# EAGLE design SmartHomePLC_Licenta.V2sch (EAGLE 6.6.0)
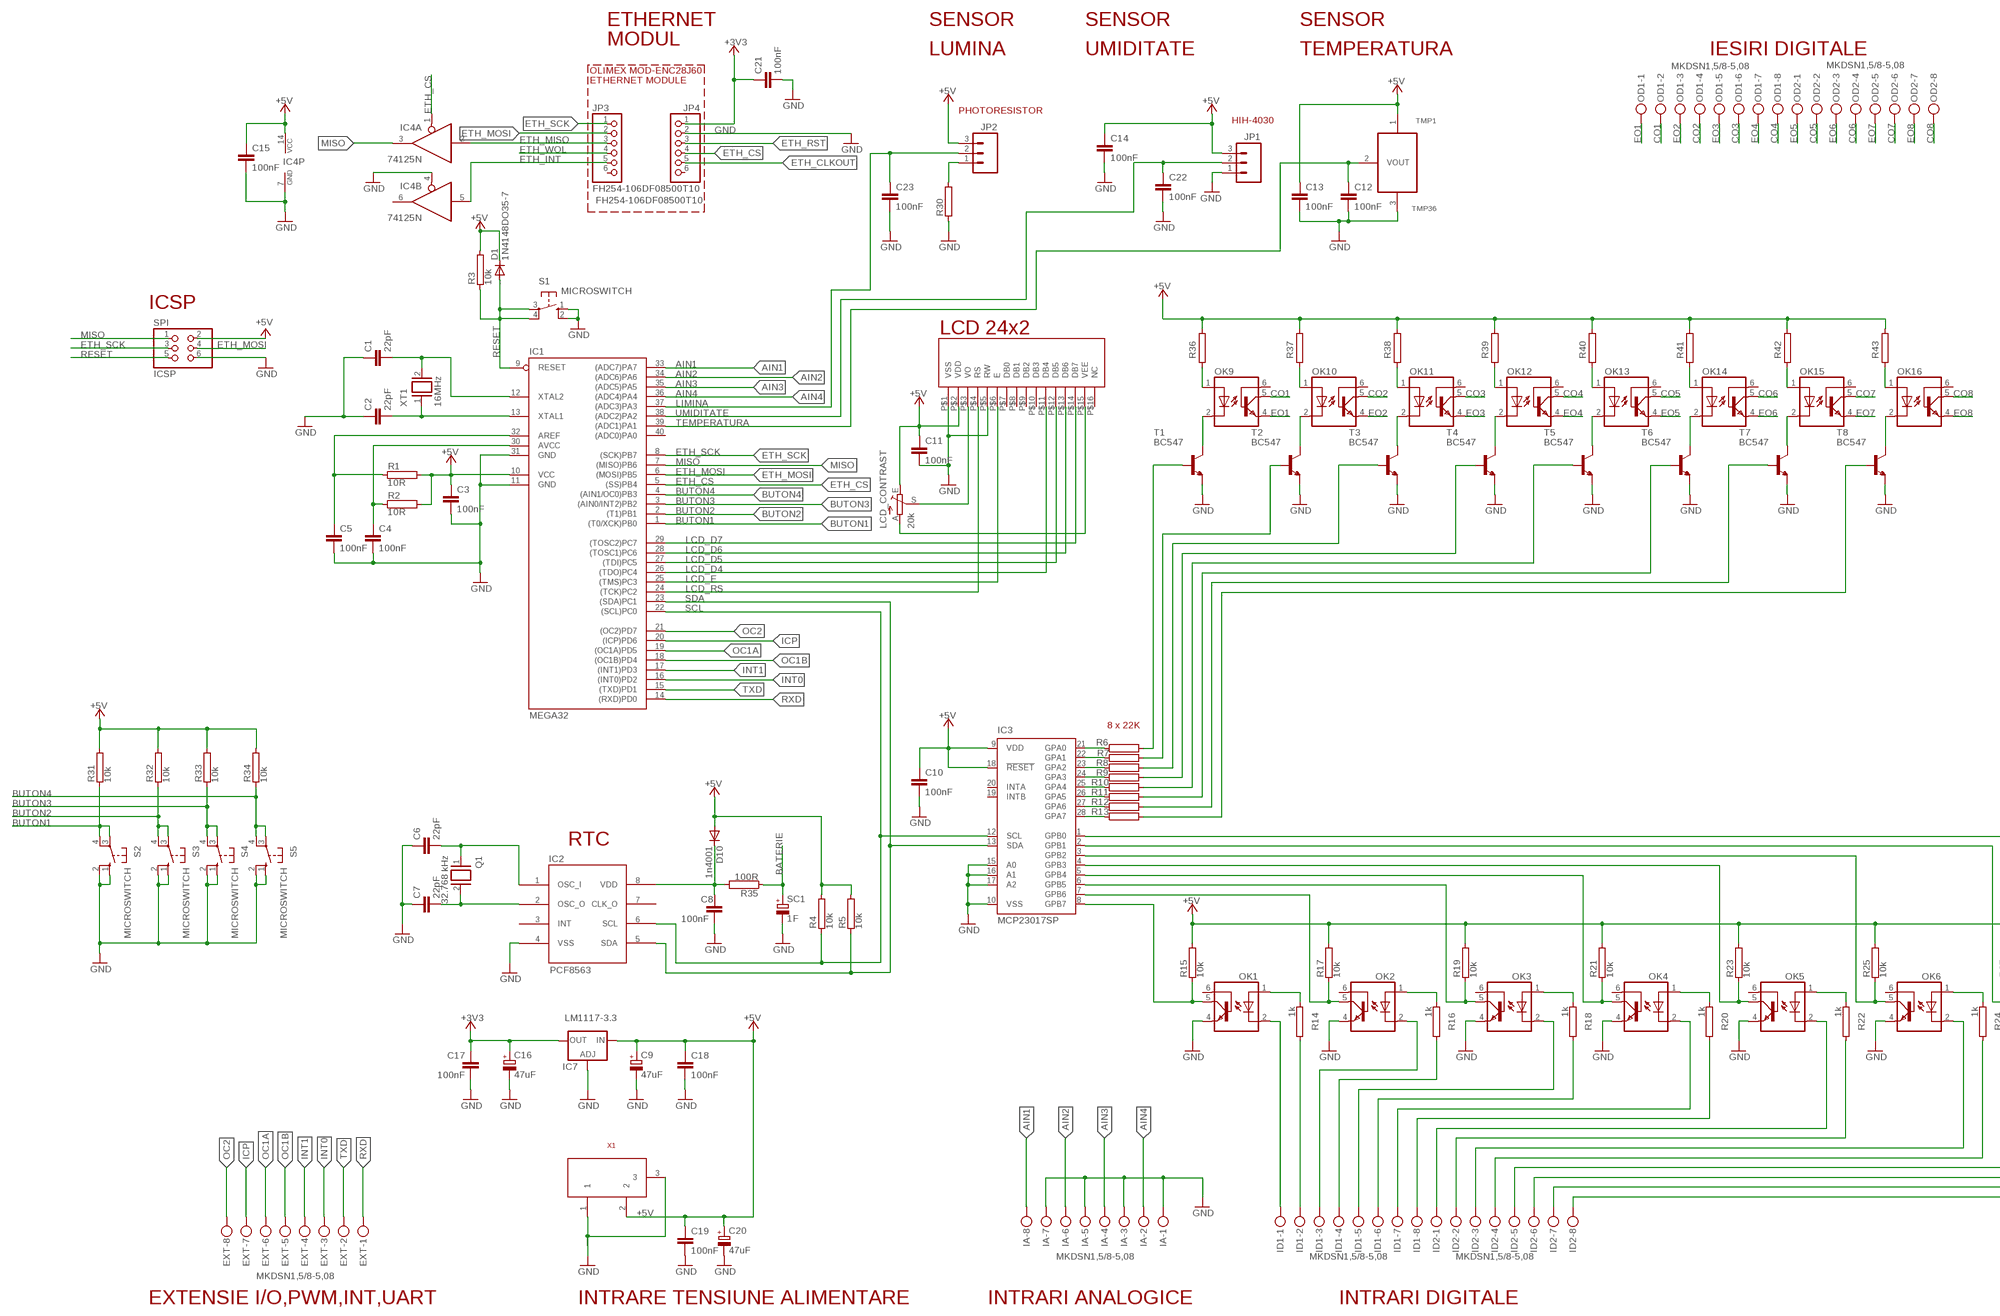
[diagram p0: schematic, sheet 1, part 1 of 2]
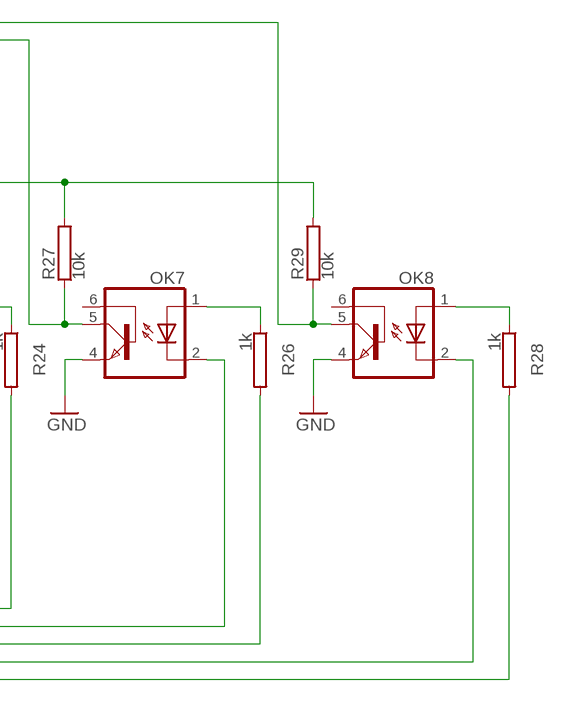
[diagram p1: schematic, sheet 1, part 2 of 2]

## Parts
C1  22pF  CAPACIOTRS2.5/2  [C2.5-2]
C2  22pF  CAPACIOTRS2.5/2  [C2.5-2]
C3  100nF  CAPACIOTRS5/2.5  [C5B2.5]
C4  100nF  CAPACIOTRS5/2.5  [C5B2.5]
C5  100nF  CAPACIOTRS5/2.5  [C5B2.5]
C6  22pF  CAPACIOTRS2.5/2  [C2.5-2]
C7  22pF  CAPACIOTRS2.5/2  [C2.5-2]
C8  100nF  CAPACIOTRS5/2.5  [C5B2.5]
C9  47uF  CAPACITORS_POLE3.5-8  [E3,5-8]
C10  100nF  CAPACIOTRS5/2.5  [C5B2.5]
C11  100nF  CAPACIOTRS5/2.5  [C5B2.5]
C12  100nF  CAPACIOTRS5/2.5  [C5B2.5]
C13  100nF  CAPACIOTRS5/2.5  [C5B2.5]
C14  100nF  CAPACIOTRS5/2.5  [C5B2.5]
C15  100nF  CAPACIOTRS5/2.5  [C5B2.5]
C16  47uF  CAPACITORS_POLE3.5-8  [E3,5-8]
C17  100nF  CAPACIOTRS5/2.5  [C5B2.5]
C18  100nF  CAPACIOTRS5/2.5  [C5B2.5]
C19  100nF  CAPACIOTRS5/2.5  [C5B2.5]
C20  47uF  CAPACITORS_POLE3.5-8  [E3,5-8]
C21  100nF  CAPACIOTRS5/2.5  [C5B2.5]
C22  100nF  CAPACIOTRS5/2.5  [C5B2.5]
C23  100nF  CAPACIOTRS5/2.5  [C5B2.5]
D1  1N4148DO35-7  [DO35-7]
D10  1n4001  1N4148DO35-10  [DO35-10]
EXT  MKDSN1,5/8-5,08  [MKDSN1,5/8-5,08]
IA  MKDSN1,5/8-5,08  [MKDSN1,5/8-5,08]
IC1  MEGA32  MEGA16-P  [DIL40]
IC2  PCF8563P  [DIL08]
IC3  MCP23017SP  [DIL28-3]
IC4  74125N  [DIL14]
IC7  LM1117-3.3  [317TS]
ID1  MKDSN1,5/8-5,08  [MKDSN1,5/8-5,08]
ID2  MKDSN1,5/8-5,08  [MKDSN1,5/8-5,08]
JP1  M03LONGPADS  [1X03_LONGPADS]
JP2  M03LONGPADS  [1X03_LONGPADS]
JP3  FH254-106DF08500T10  6X1_F_H8,5_P2,54_STD  [1X06]
JP4  FH254-106DF08500T10  6X1_F_H8,5_P2,54_STD  [1X06]
LCD_CONTRAST  20k  TRIM_EU-CA6V  [CA6V]
OD1  MKDSN1,5/8-5,08  [MKDSN1,5/8-5,08]
OD2  MKDSN1,5/8-5,08  [MKDSN1,5/8-5,08]
OK1  4N35  [DIL06]
OK2  4N35  [DIL06]
OK3  4N35  [DIL06]
OK4  4N35  [DIL06]
OK5  4N35  [DIL06]
OK6  4N35  [DIL06]
OK7  4N35  [DIL06]
OK8  4N35  [DIL06]
OK9  4N35  [DIL06]
OK10  4N35  [DIL06]
OK11  4N35  [DIL06]
OK12  4N35  [DIL06]
OK13  4N35  [DIL06]
OK14  4N35  [DIL06]
OK15  4N35  [DIL06]
OK16  4N35  [DIL06]
Q1  32.768 kHz  CRYSTAL_THT  [QS]
R1  10R  REZISTORSRS1/8  [RS1/8]
R2  10R  REZISTORSRS1/8  [RS1/8]
R3  10k  REZISTORSRS1/8  [RS1/8]
R4  10k  REZISTORSRS1/8  [RS1/8]
R5  10k  REZISTORSRS1/8  [RS1/8]
R6  REZISTORSRS1/8  [RS1/8]
R7  REZISTORSRS1/8  [RS1/8]
R8  REZISTORSRS1/8  [RS1/8]
R9  REZISTORSRS1/8  [RS1/8]
R10  REZISTORSRS1/8  [RS1/8]
R11  REZISTORSRS1/8  [RS1/8]
R12  REZISTORSRS1/8  [RS1/8]
R13  REZISTORSRS1/8  [RS1/8]
R14  1k  REZISTORSRS1/8  [RS1/8]
R15  10k  REZISTORSRS1/8  [RS1/8]
R16  1k  REZISTORSRS1/8  [RS1/8]
R17  10k  REZISTORSRS1/8  [RS1/8]
R18  1k  REZISTORSRS1/8  [RS1/8]
R19  10k  REZISTORSRS1/8  [RS1/8]
R20  1k  REZISTORSRS1/8  [RS1/8]
R21  10k  REZISTORSRS1/8  [RS1/8]
R22  1k  REZISTORSRS1/8  [RS1/8]
R23  10k  REZISTORSRS1/8  [RS1/8]
R24  1k  REZISTORSRS1/8  [RS1/8]
R25  10k  REZISTORSRS1/8  [RS1/8]
R26  1k  REZISTORSRS1/8  [RS1/8]
R27  10k  REZISTORSRS1/8  [RS1/8]
R28  1k  REZISTORSRS1/8  [RS1/8]
R29  10k  REZISTORSRS1/8  [RS1/8]
R30  REZISTORSRS1/8  [RS1/8]
R31  10k  REZISTORSRS1/8  [RS1/8]
R32  10k  REZISTORSRS1/8  [RS1/8]
R33  10k  REZISTORSRS1/8  [RS1/8]
R34  10k  REZISTORSRS1/8  [RS1/8]
R35  100R  REZISTORSRS1/8  [RS1/8]
R36  REZISTORSRS1/8  [RS1/8]
R37  REZISTORSRS1/8  [RS1/8]
R38  REZISTORSRS1/8  [RS1/8]
R39  REZISTORSRS1/8  [RS1/8]
R40  REZISTORSRS1/8  [RS1/8]
R41  REZISTORSRS1/8  [RS1/8]
R42  REZISTORSRS1/8  [RS1/8]
R43  REZISTORSRS1/8  [RS1/8]
S1  MICROSWITCH  [B3F-10XX]
S2  MICROSWITCH  [B3F-10XX]
S3  MICROSWITCH  [B3F-10XX]
S4  MICROSWITCH  [B3F-10XX]
S5  MICROSWITCH  [B3F-10XX]
SC1  1F  1F_SUPERCAPACITOR  [DYNACAP-DB_1_3]
SPI  ICSP  3X2_V_H8,5_P2,54  [2X03]
T1  BC547  [BC-TO92]
T2  BC547  [BC-TO92]
T3  BC547  [BC-TO92]
T4  BC547  [BC-TO92]
T5  BC547  [BC-TO92]
T6  BC547  [BC-TO92]
T7  BC547  [BC-TO92]
T8  BC547  [BC-TO92]
TMP1  TMP36  [BC-TO92]
U1  LCD_RC2402  [LCD_RC2402]
X1  0018_19746-POWER-SUPPLY  [POWERSUPPLY_DC-21MM]
XT1  16MHz  CRYSTAL_THT  [QS]

## Nets
+3V3: C16.+ C17.1 C21.1 IC7.2(OUT) JP4.1
+5V: C3.1 C9.+ C10.1 C11.1 C13.1 C14.1 C15.1 C18.1 C19.1 C20.+ D1.C D10.A IC1.10(VCC) IC3.9(VDD) IC3.18(!RESET) IC4.14(P:VCC) IC7.3(IN) JP1.3 JP2.3 LCD_CONTRAST.E R1.2 R2.2 R3.2 R4.2 R5.2 R15.2 R17.2 R19.2 R21.2 R23.2 R25.2 R27.2 R29.2 R31.2 R32.2 R33.2 R34.2 R36.2 R37.2 R38.2 R39.2 R40.2 R41.2 R42.2 R43.2 SPI.2 TMP1.1(+VS) U1.P$2(VDD) X1.2
AIN1: IA.8 IC1.33((ADC7)PA7)
AIN2: IA.6 IC1.34((ADC6)PA6)
AIN3: IA.4 IC1.35((ADC5)PA5)
AIN4: IA.2 IC1.36((ADC4)PA4)
BATERIE: R35.1 SC1.+
BUTON1: IC1.1((T0/XCK)PB0) R31.1 S2.3(P) S2.4(P1)
BUTON2: IC1.2((T1)PB1) R32.1 S3.3(P) S3.4(P1)
BUTON3: IC1.3((AIN0/INT2)PB2) R33.1 S4.3(P) S4.4(P1)
BUTON4: IC1.4((AIN1/OC0)PB3) R34.1 S5.3(P) S5.4(P1)
CO1: OD1.2 OK9.5(COL)
CO2: OD1.4 OK10.5(COL)
CO3: OD1.6 OK11.5(COL)
CO4: OD1.8 OK12.5(COL)
CO5: OD2.2 OK13.5(COL)
CO6: OD2.4 OK14.5(COL)
CO7: OD2.6 OK15.5(COL)
CO8: OD2.8 OK16.5(COL)
EO1: OD1.1 OK9.4(EMI)
EO2: OD1.3 OK10.4(EMI)
EO3: OD1.5 OK11.4(EMI)
EO4: OD1.7 OK12.4(EMI)
EO5: OD2.1 OK13.4(EMI)
EO6: OD2.3 OK14.4(EMI)
EO7: OD2.5 OK15.4(EMI)
EO8: OD2.7 OK16.4(EMI)
ETH_CLKOUT: JP4.5
ETH_CS: IC1.5((SS)PB4) IC4.1(A:OE) JP4.4
ETH_INT: IC4.5(B:I) JP3.5
ETH_MISO: IC4.2(A:I) JP3.3
ETH_MOSI: IC1.6((MOSI)PB5) JP3.2 SPI.4
ETH_RST: JP4.3
ETH_SCK: IC1.8((SCK)PB7) JP3.1 SPI.3
ETH_WOL: JP3.4
GND: C1.1 C2.1 C3.2 C4.2 C5.2 C6.1 C7.1 C8.2 C9.- C10.2 C11.2 C12.2 C13.2 C14.2 C15.2 C16.- C17.2 C18.2 C19.2 C20.- C21.2 C22.2 C23.2 IA.1 IA.3 IA.5 IA.7 IC1.11(GND) IC1.31(GND) IC2.4(VSS) IC3.10(VSS) IC3.15(A0) IC3.16(A1) IC3.17(A2) IC4.4(B:OE) IC4.7(P:GND) IC7.1(ADJ) JP1.1 JP4.2 OK1.4(EMI) OK2.4(EMI) OK3.4(EMI) OK4.4(EMI) OK5.4(EMI) OK6.4(EMI) OK7.4(EMI) OK8.4(EMI) R30.1 S1.1(S) S1.2(S1) S2.1(S) S2.2(S1) S3.1(S) S3.2(S1) S4.1(S) S4.2(S1) S5.1(S) S5.2(S1) SC1.- SPI.6 T1.1(E) T2.1(E) T3.1(E) T4.1(E) T5.1(E) T6.1(E) T7.1(E) T8.1(E) TMP1.3(GND) U1.P$1(VSS) U1.P$5(RW) X1.1 X1.3
ICP: EXT.7 IC1.20((ICP)PD6)
INT0: EXT.3 IC1.16((INT0)PD2)
INT1: EXT.4 IC1.17((INT1)PD3)
LCD_D4: IC1.26((TDO)PC4) U1.P$11(DB4)
LCD_D5: IC1.27((TDI)PC5) U1.P$12(DB5)
LCD_D6: IC1.28((TOSC1)PC6) U1.P$13(DB6)
LCD_D7: IC1.29((TOSC2)PC7) U1.P$14(DB7)
LCD_E: IC1.25((TMS)PC3) U1.P$6(E)
LCD_RS: IC1.24((TCK)PC2) U1.P$4(RS)
LIMINA: C23.1 IC1.37((ADC3)PA3) JP2.2
MISO: IC1.7((MISO)PB6) IC4.3(A:O) SPI.1
N$1: C1.2 IC1.12(XTAL2) XT1.2
N$2: C2.2 IC1.13(XTAL1) XT1.1
N$3: C7.2 IC2.2(OSC_O) Q1.2
N$4: C4.1 IC1.30(AVCC) R2.1
N$5: C5.1 IC1.32(AREF) R1.1
N$6: IC3.28(GPA7) R13.1
N$7: IC3.27(GPA6) R12.1
N$8: IC3.26(GPA5) R11.1
N$9: IC3.25(GPA4) R10.1
N$10: IC3.24(GPA3) R9.1
N$11: C6.2 IC2.1(OSC_I) Q1.1
N$12: IC3.23(GPA2) R8.1
N$13: IC3.22(GPA1) R7.1
N$14: OK9.1(A) R36.1
N$15: IC3.21(GPA0) R6.1
N$16: OK9.2(C) T1.3(C)
N$17: OK10.1(A) R37.1
N$18: R6.2 T1.2(B)
N$19: R7.2 T2.2(B)
N$20: OK11.1(A) R38.1
N$21: R8.2 T3.2(B)
N$22: R9.2 T4.2(B)
N$23: OK12.1(A) R39.1
N$24: OK13.1(A) R40.1
N$25: R10.2 T5.2(B)
N$26: LCD_CONTRAST.S U1.P$3(VO)
N$27: LCD_CONTRAST.A U1.P$15(VEE)
N$28: R11.2 T6.2(B)
N$29: OK14.1(A) R41.1
N$30: OK15.1(A) R42.1
N$31: R12.2 T7.2(B)
N$32: R13.2 T8.2(B)
N$33: OK1.1(A) R14.1
N$34: IC3.8(GPB7) OK1.5(COL) R15.1
N$35: ID1.1 OK1.2(C)
N$36: OK16.1(A) R43.1
N$37: IC3.7(GPB6) OK2.5(COL) R17.1
N$38: OK2.1(A) R16.1
N$39: ID1.3 OK2.2(C)
N$40: ID1.4 R16.2
N$41: IC3.6(GPB5) OK3.5(COL) R19.1
N$42: OK3.1(A) R18.1
N$43: ID1.5 OK3.2(C)
N$44: ID1.6 R18.2
N$45: IC3.5(GPB4) OK4.5(COL) R21.1
N$46: OK4.1(A) R20.1
N$47: ID1.7 OK4.2(C)
N$48: ID1.8 R20.2
N$49: IC3.4(GPB3) OK5.5(COL) R23.1
N$50: OK5.1(A) R22.1
N$51: ID2.1 OK5.2(C)
N$52: ID2.2 R22.2
N$53: IC3.3(GPB2) OK6.5(COL) R25.1
N$54: OK6.1(A) R24.1
N$55: ID2.3 OK6.2(C)
N$56: ID2.4 R24.2
N$57: IC3.2(GPB1) OK7.5(COL) R27.1
N$58: OK7.1(A) R26.1
N$59: OK10.2(C) T2.3(C)
N$60: ID2.6 R26.2
N$61: IC3.1(GPB0) OK8.5(COL) R29.1
N$62: OK8.1(A) R28.1
N$63: ID2.7 OK8.2(C)
N$64: ID2.8 R28.2
N$65: JP2.1 R30.2
N$66: OK11.2(C) T3.3(C)
N$67: OK12.2(C) T4.3(C)
N$68: OK13.2(C) T5.3(C)
N$69: OK14.2(C) T6.3(C)
N$70: OK15.2(C) T7.3(C)
N$71: OK16.2(C) T8.3(C)
N$86: ID2.5 OK7.2(C)
N$90: C8.1 D10.C IC2.8(VDD) R35.2
N$91: ID1.2 R14.2
OC1A: EXT.6 IC1.19((OC1A)PD5)
OC1B: EXT.5 IC1.18((OC1B)PD4)
OC2: EXT.8 IC1.21((OC2)PD7)
RESET: D1.A IC1.9(RESET) R3.1 S1.3(P) S1.4(P1) SPI.5
RXD: EXT.1 IC1.14((RXD)PD0)
SCL: IC1.22((SCL)PC0) IC2.6(SCL) IC3.12(SCL) R4.1
SDA: IC1.23((SDA)PC1) IC2.5(SDA) IC3.13(SDA) R5.1
TEMPERATURA: C12.1 IC1.39((ADC1)PA1) TMP1.2(VOUT)
TXD: EXT.2 IC1.15((TXD)PD1)
UMIDITATE: C22.1 IC1.38((ADC2)PA2) JP1.2
Unconnected: IC1.40((ADC0)PA0) IC2.3(INT) IC2.7(CLK_O) IC3.19(INTB) IC3.20(INTA) IC4.6(B:O) IC4.8(C:O) IC4.9(C:I) IC4.10(C:OE) IC4.11(D:O) IC4.12(D:I) IC4.13(D:OE) JP3.6 JP4.6 OK1.6(BAS) OK2.6(BAS) OK3.6(BAS) OK4.6(BAS) OK5.6(BAS) OK6.6(BAS) OK7.6(BAS) OK8.6(BAS) OK9.6(BAS) OK10.6(BAS) OK11.6(BAS) OK12.6(BAS) OK13.6(BAS) OK14.6(BAS) OK15.6(BAS) OK16.6(BAS) U1.P$7(DB0) U1.P$8(DB1) U1.P$9(DB2) U1.P$10(DB3) U1.P$16(NC)

## Notes on the sheet
- ETHERNET | SENSOR | SENSOR | SENSOR
- MODUL
- LUMINA | UMIDITATE | TEMPERATURA | IESIRI DIGITALE
- OLIMEX MOD-ENC28J60
- ETHERNET MODULE
- PHOTORESISTOR
- HIH-4030
- ICSP
- LCD 24x2
- 8 x 22K
- RTC
- EXTENSIE I/O,PWM,INT,UART | INTRARE TENSIUNE ALIMENTARE | INTRARI ANALOGICE | INTRARI DIGITALE

## Library data of the parts
C1-C8 C10-C15 C17-C19 C21-C23 = SmartHomePLC_Licenta:CAPACIOTRS: CAPACITOR naming: grid - package width; LIBRARY: SmartHomePLC; TYPE: capacitor
C9 C16 C20 = SmartHomePLC_Licenta:CAPACITORS_POL: POLARIZED CAPACITOR, European symbol
D1 D10 = SmartHomePLC_Licenta:1N4148: DIODE high speed (Philips); LIBRARY: SmartHomePLC; TYPE: diode
EXT IA ID1 ID2 OD1 OD2 = SmartHomePLC_Licenta:MKDSN1,5/8-5,08: MKDSN 1,5/ 8-5,08 Printklemme Nennstrom: 13,5 A Nennspannung: 250 V Rastermaß: 5,08 mm Polzahl: 8 Anschlussart: Schraubanschluss Montage: Löten Anschlussrichtung Leiter/Platine: 0 ° Artikelnummer: 1729186 Source: http://eshop.phoenixcontact.com .. 1729186.pdf; LIBRARY: SmartHomePLC; TYPE: conector power
IC1 = SmartHomePLC_Licenta:MEGA16-P: MICROCONTROLLER 16 Kbytes FLASH 1 kbytes SRAM 512 bytes EEPROM USART 8-channel 10 bit ADC Source: avr.lbr; LIBRARY: SmartHomePLC; TYPE: microcontroler
IC2 = SmartHomePLC_Licenta:PCF8563P; LIBRARY: SmartHomePLC; TYPE: IC
IC3 = SmartHomePLC_Licenta:MCP23017: http://ww1.microchip.com/downloads/en/DeviceDoc/21952a.pdf Source: http://ww1.microchip.com/downloads/en/DeviceDoc/21952a.pdf; LIBRARY: SmartHomePLC; TYPE: IC
IC4 = SmartHomePLC_Licenta:74*125: Quad bus BUFFER, 3-state; LIBRARY: SmartHomePLC; TYPE: IC
IC7 = SmartHomePLC_Licenta:LM1117-3.3: 800mA Low-Dropout Linear Regulator
JP1 JP2 = SmartHomePLC_Licenta:M03: Header 3 Standard 3-pin 0.1" header. Use with straight break away headers (SKU : PRT-00116), right angle break away headers (PRT-00553), swiss pins (PRT-00743), machine pins (PRT-00117), and female headers (PRT-00115). Molex polarized connector foot print use with SKU : PRT-08232 with associated crimp pins and housings.; LIBRARY: SmartHomePLC; TYPE: connector header pcb
JP3 JP4 = SmartHomePLC_Licenta:6X1_F_H8,5_P2,54: 6x1 V h 8,5 p2,54mm; LIBRARY: SmartHomePLC; TYPE: conector header pcb
LCD_CONTRAST = SmartHomePLC_Licenta:TRIM_EU-: POTENTIOMETER; LIBRARY: SmartHomePLC; TYPE: Trimer POT
OK1-OK16 = SmartHomePLC_Licenta:4N35: General Purpose 6-Pin Phototransistor Optocouplers Source: http://www.fairchildsemi.com/ds/4N/4N35-M.pdf; LIBRARY: SmartHomePLC; TYPE: optocoupler
Q1 XT1 = SmartHomePLC_Licenta:CRYSTAL_THT: 16MHz THT; LIBRARY: SmartHomePLC; TYPE: Cristal de quartz
R1-R43 = SmartHomePLC_Licenta:REZISTORS: Power Resitor; LIBRARY: SmartHomePLC; TYPE: Rezistori
S1-S5 = SmartHomePLC_Licenta:MICROSWITCH: OMRON SWITCH; LIBRARY: SmartHomePLC; TYPE: buton
SC1 = SmartHomePLC_Licenta:1F_SUPERCAPACITOR: Panasonic Electric Double Layer Capacitors (Gold Capacitor)/ NF type Mouser Part No: 667-EEC-F5R5U105 Manufacturer Part No: EEC-F5R5U105; LIBRARY: SmartHomePLC; TYPE: capacitor
SPI = SmartHomePLC_Licenta:3X2_V_H8,5_P2,54: 3x2 M V h 8,5 mm p2,54; LIBRARY: SmartHomePLC; TYPE: conector header pcb
T1-T8 = SmartHomePLC_Licenta:BC547: NPN TRANSISTOR; LIBRARY: SmartHomePLC; TYPE: tranzistor
TMP1 = SmartHomePLC_Licenta:TMP36: TMP36; LIBRARY: SmartHomePLC; TYPE: sensor
U1 = SmartHomePLC_Licenta:LCD_RC2402: LCD alphanumeric 24x2; LIBRARY: SmartHomePLC; TYPE: LCD
X1 = Connettori:0018_19746-POWER-SUPPLY: JACK; MONTHLY_USAGE: _____; PART_NUMBER: 19746; PRICE: _____; SUPPLIER: _____; TYPE: Connettori; VALUE: POWER-SUPPLY

## Net classes
0 default: width 0.203 mm, drill 0.406 mm, clearance 0.203 mm
1 PWR: width 0.203 mm, drill 0.61 mm, clearance 0.203 mm
2 gnd: width 0.254 mm, drill 0.254 mm, clearance 0.178 mm

## Board
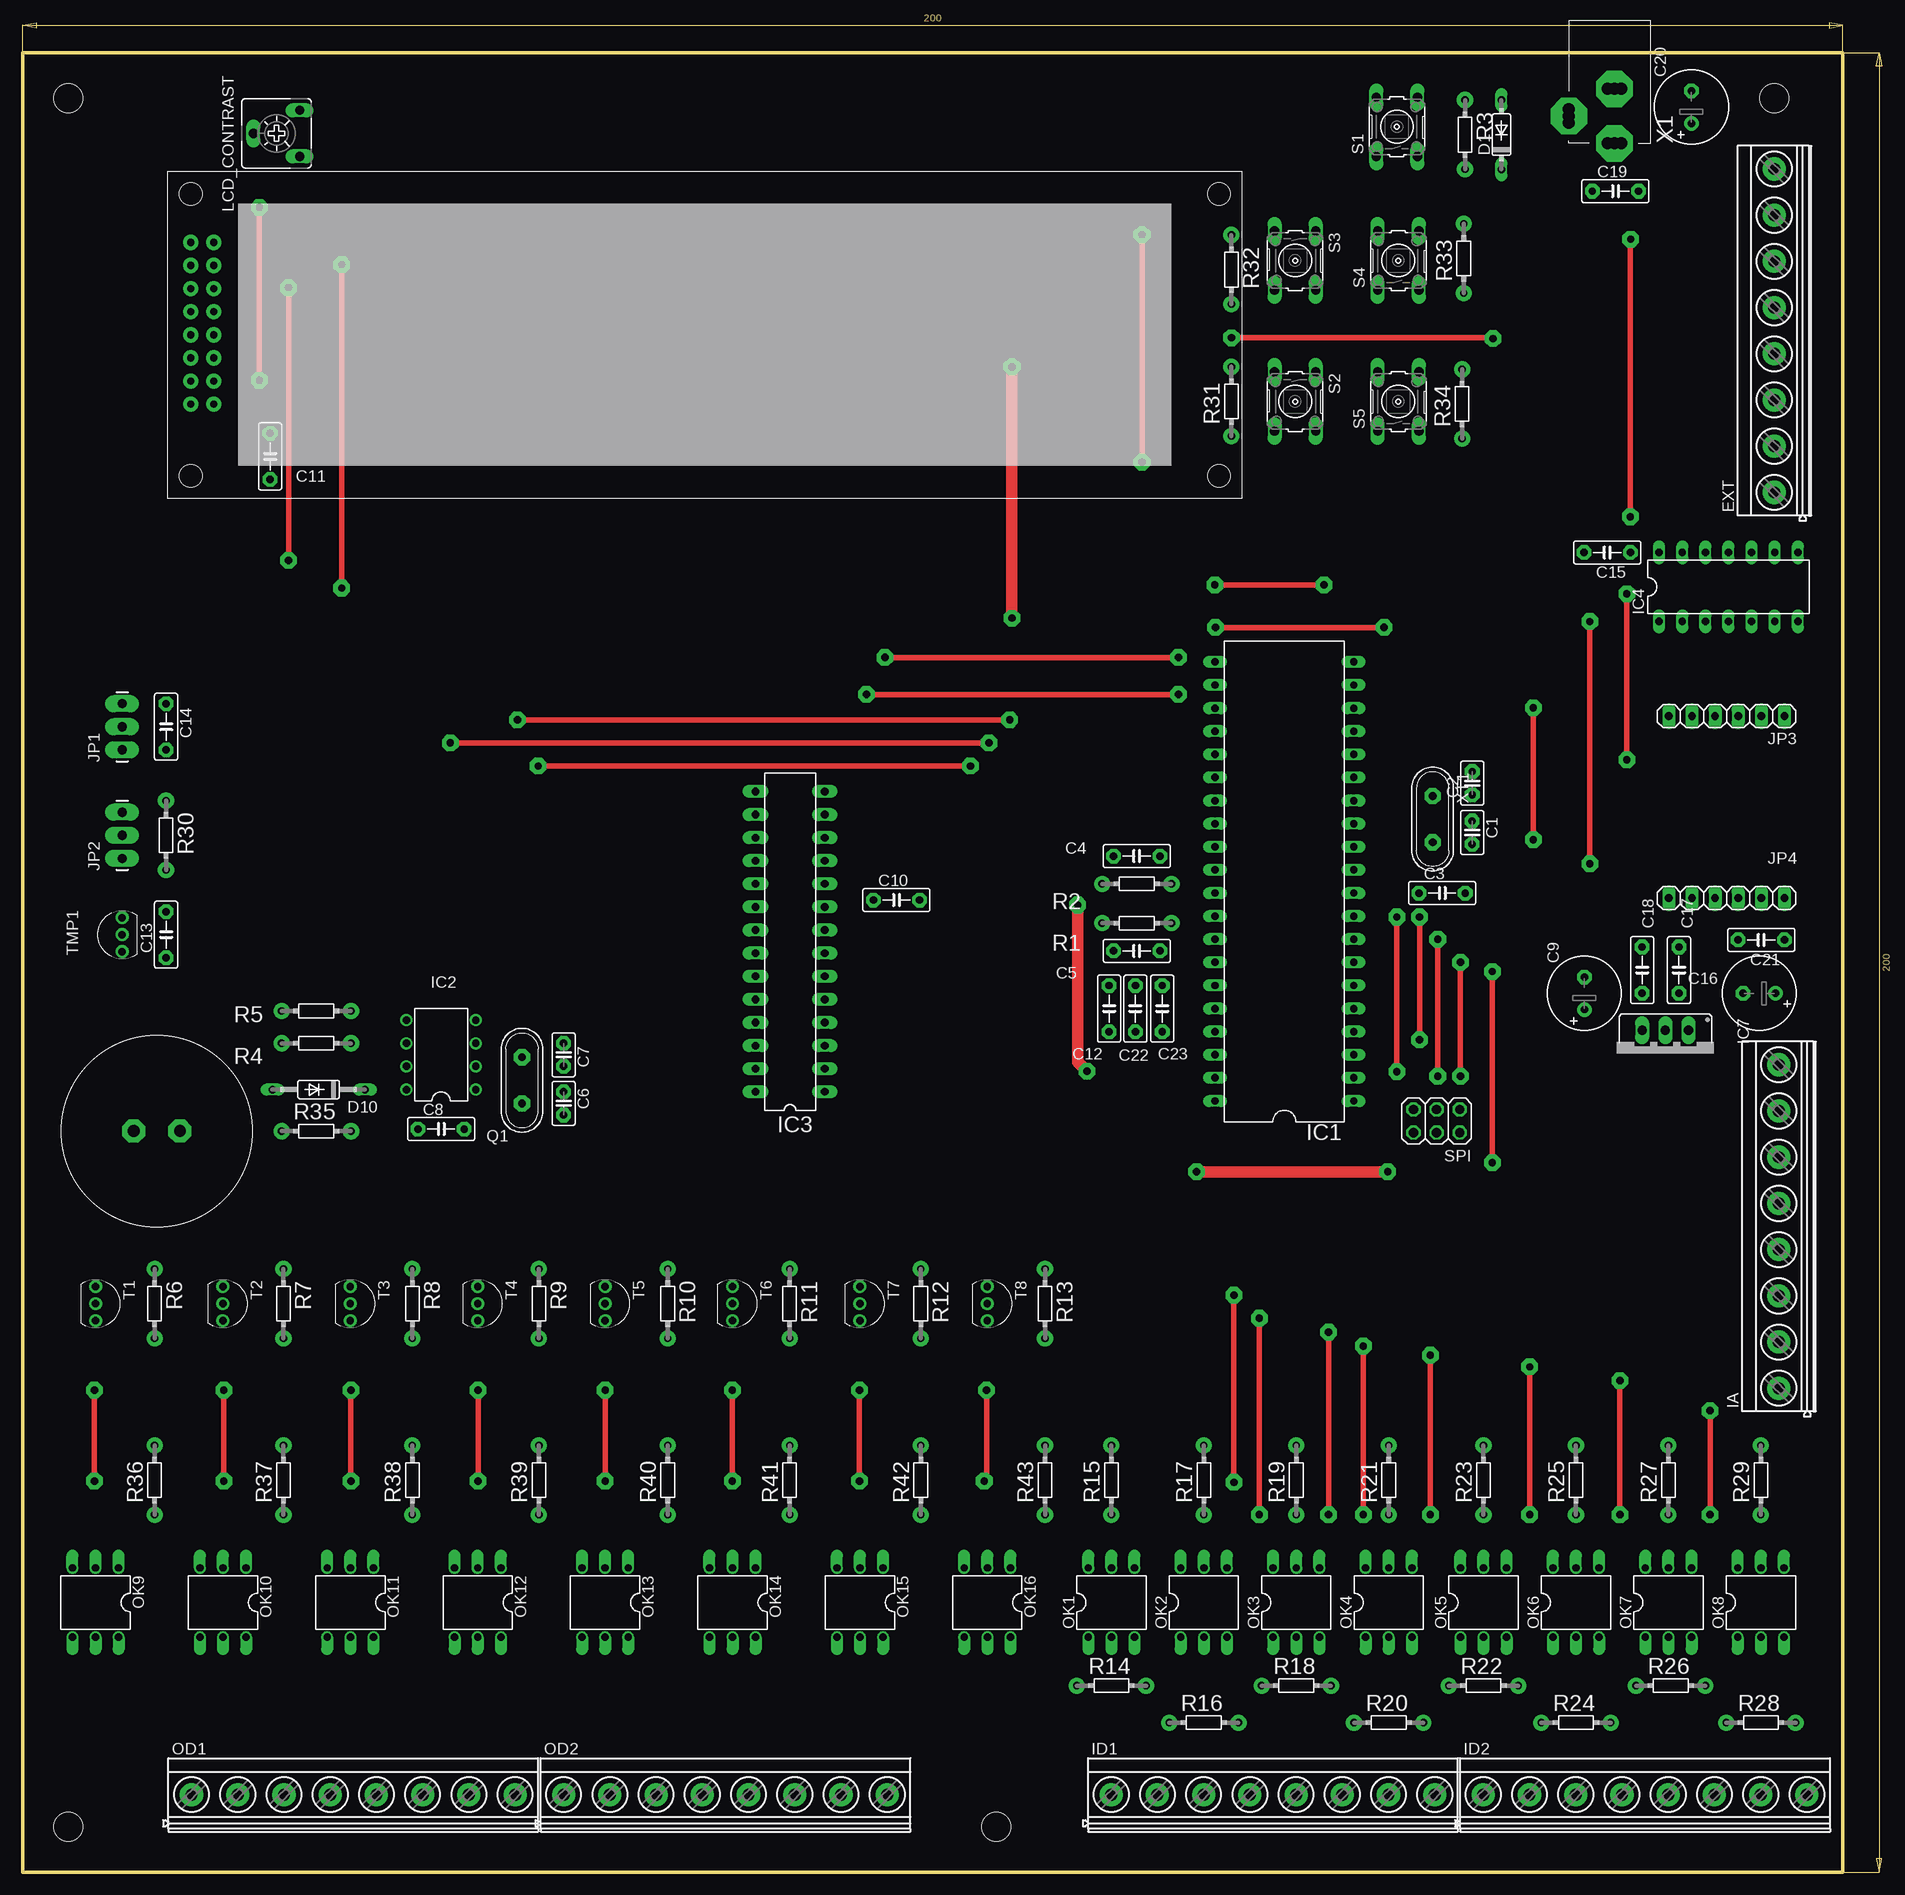
[diagram p2: board, top side]
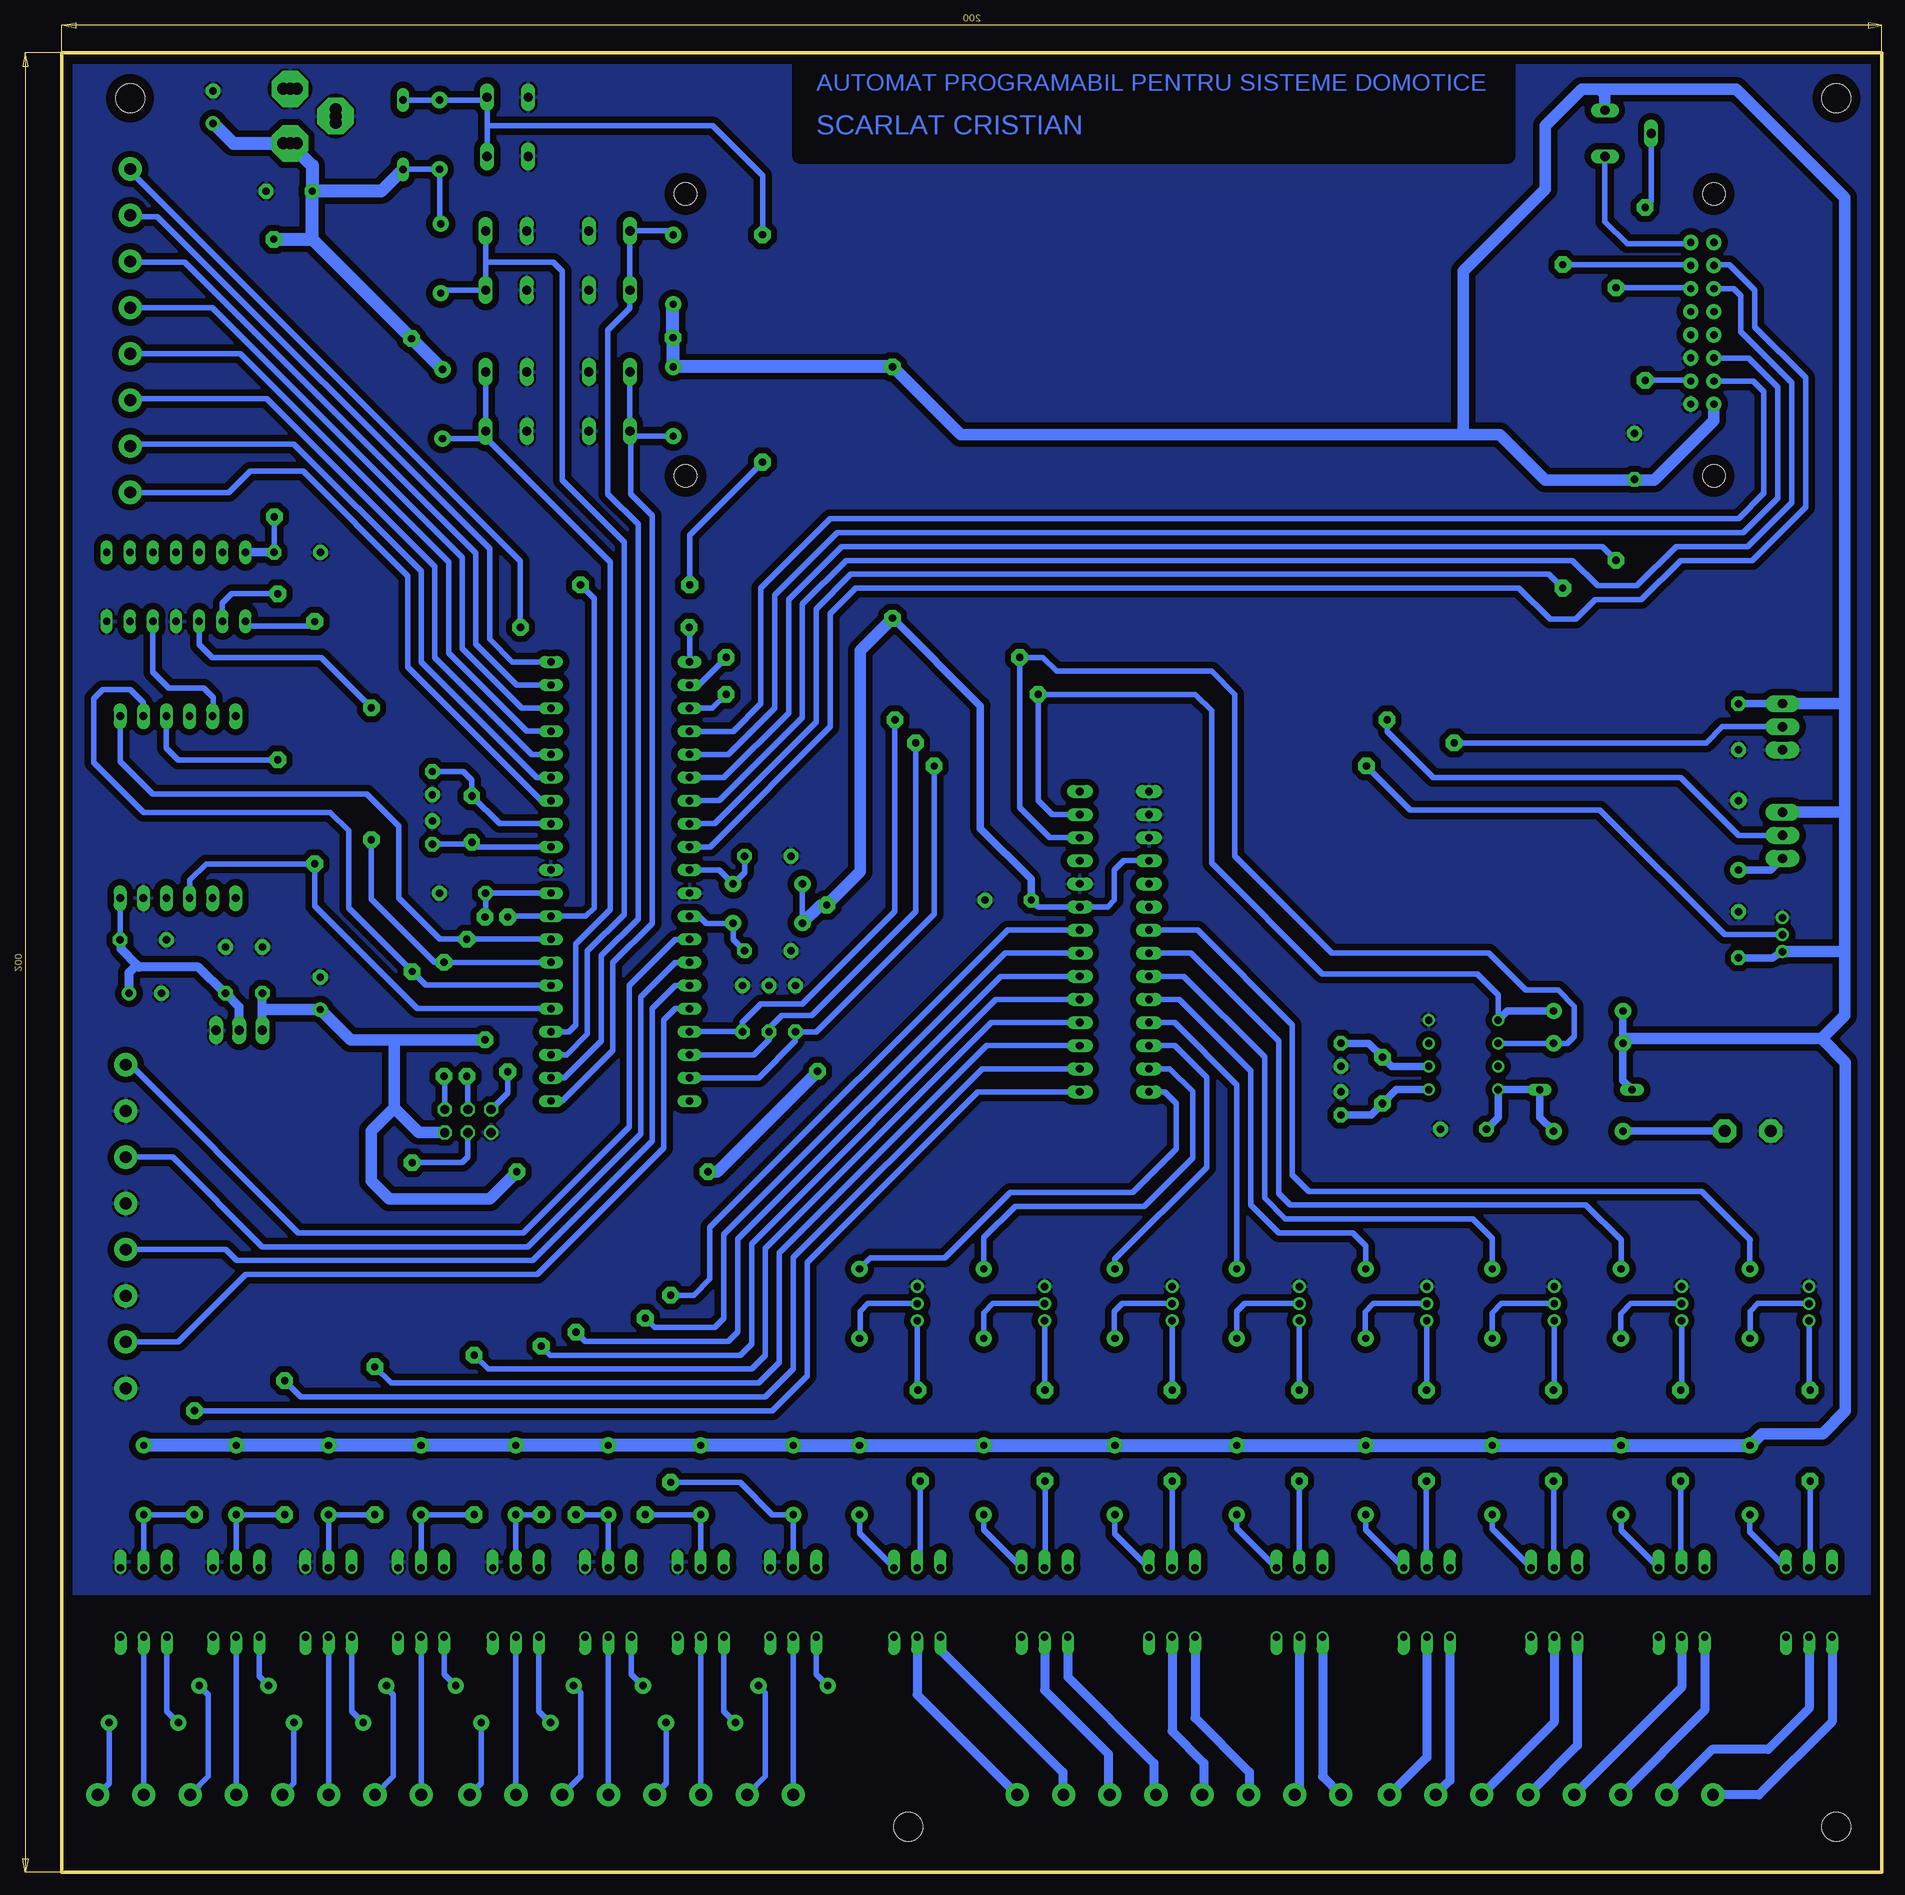
[diagram p3: board, bottom side, seen from below]

Size 200 x 200 mm. Coordinates in mm from the lower left corner, seen from the top.
Outline: 0,0 200,0 200,200 0,200 0,0
Copper layers (1*16): Top 0.035mm / dielectric 1.5mm / Bottom 0.035mm
Design rules "default *": minimum track width 10mil, minimum drill 24mil, track to track 8mil, track to pad 8mil, pad to pad 8mil, via to via 8mil, smd to smd 8mil, copper to edge 40mil, drill to drill 8mil, minimum pad ring 10mil, minimum via ring 20mil, stop-mask expansion 4mil, vias tented up to drill 0mil, thermal gap 10mil
Holes 3.2 mm at 5,5 107,5 5,195 192.5,195
bRestrict: 3 lines

### Footprints (pad centres in the part's own frame; a part is rotated, then mirrored left to right if it is on the bottom)
C2.5-2 = drill 0.813 pad 1.6 octagon: 1 -1.27,0; 2 1.27,0
C5B2.5 = drill 0.813 pad 1.6 octagon: 1 -2.54,0; 2 2.54,0
E3,5-8 = drill 0.813 pad 1.6: + -1.778,0 | drill 0.813 pad 1.6 octagon: - 1.778,0
DO35-7 = drill 0.813 long: A 3.81,0; C -3.81,0
DO35-10 = drill 0.813 long: A 5.08,0; C -5.08,0
MKDSN1,5/8-5,08 = drill 1.3 pad 2.54: 1 -17.801,0.025; 2 -12.721,0.025; 3 -7.641,0.025; 4 -2.561,0.025; 5 2.519,0.025; 6 7.599,0.025; 7 12.679,0.025; 8 17.759,0.025
DIL40 = drill 0.813 long: 1 -24.13,-7.62; 2 -21.59,-7.62; 3 -19.05,-7.62; 4 -16.51,-7.62; 5 -13.97,-7.62; 6 -11.43,-7.62; 7 -8.89,-7.62; 8 -6.35,-7.62; 9 -3.81,-7.62; 10 -1.27,-7.62; 11 1.27,-7.62; 12 3.81,-7.62; 13 6.35,-7.62; 14 8.89,-7.62; 15 11.43,-7.62; 16 13.97,-7.62; 17 16.51,-7.62; 18 19.05,-7.62; 19 21.59,-7.62; 20 24.13,-7.62; 21 24.13,7.62; 22 21.59,7.62; 23 19.05,7.62; 24 16.51,7.62; 25 13.97,7.62; 26 11.43,7.62; 27 8.89,7.62; 28 6.35,7.62; 29 3.81,7.62; 30 1.27,7.62; 31 -1.27,7.62; 32 -3.81,7.62; 33 -6.35,7.62; 34 -8.89,7.62; 35 -11.43,7.62; 36 -13.97,7.62; 37 -16.51,7.62; 38 -19.05,7.62; 39 -21.59,7.62; 40 -24.13,7.62
DIL08 = drill 0.813 pad 1.27: 1 -3.81,-3.81; 2 -1.27,-3.81; 3 1.27,-3.81; 4 3.81,-3.81; 5 3.81,3.81; 6 1.27,3.81; 7 -1.27,3.81; 8 -3.81,3.81
DIL28-3 = drill 0.85 pad 1.422 long: 1 -16.51,-3.81; 2 -13.97,-3.81; 3 -11.43,-3.81; 4 -8.89,-3.81; 5 -6.35,-3.81; 6 -3.81,-3.81; 7 -1.27,-3.81; 8 1.27,-3.81; 9 3.81,-3.81; 10 6.35,-3.81; 11 8.89,-3.81; 12 11.43,-3.81; 13 13.97,-3.81; 14 16.51,-3.81; 15 16.51,3.81; 16 13.97,3.81; 17 11.43,3.81; 18 8.89,3.81; 19 6.35,3.81; 20 3.81,3.81; 21 1.27,3.81; 22 -1.27,3.81; 23 -3.81,3.81; 24 -6.35,3.81; 25 -8.89,3.81; 26 -11.43,3.81; 27 -13.97,3.81; 28 -16.51,3.81
DIL14 = drill 0.813 long: 1 -7.62,-3.81; 2 -5.08,-3.81; 3 -2.54,-3.81; 4 0,-3.81; 5 2.54,-3.81; 6 5.08,-3.81; 7 7.62,-3.81; 8 7.62,3.81; 9 5.08,3.81; 10 2.54,3.81; 11 0,3.81; 12 -2.54,3.81; 13 -5.08,3.81; 14 -7.62,3.81
317TS = drill 1.016 long: 1 -2.54,-2.54; 2 0,-2.54; 3 2.54,-2.54
1X03_LONGPADS = drill 1.016 pad 1.88 long: 1 0,0; 2 2.54,0; 3 5.08,0
1X06 = drill 0.85 pad 1.422 long: 1 -6.35,0; 2 -3.81,0; 3 -1.27,0; 4 1.27,0; 5 3.81,0; 6 6.35,0
CA6V = drill 1.016 long: A -2.54,-2.54; E 2.54,-2.54; S 0,2.54
DIL06 = drill 0.813 offset: 1 -2.54,-3.81; 2 0,-3.81; 3 2.54,-3.81; 4 2.54,3.81; 5 0,3.81; 6 -2.54,3.81
QS = drill 0.85 pad 1.778 octagon: 1 -2.54,0; 2 2.54,0
RS1/8 = drill 0.8 pad 1.778: 1 -3.81,0; 2 3.81,0
B3F-10XX = drill 1.016 long: 1 -3.251,2.261; 2 3.251,2.261; 3 -3.251,-2.261; 4 3.251,-2.261
DYNACAP-DB_1_3 = drill 1.3 pad 2.54 octagon: + 0,2.54; - 0,-2.54
2X03 = drill 1.016 pad 1.55 octagon: 1 -2.54,-1.27; 2 -2.54,1.27; 3 0,-1.27; 4 0,1.27; 5 2.54,-1.27; 6 2.54,1.27
BC-TO92 = drill 0.8 pad 1.422: 1 -1.87,0; 2 0,0; 3 1.87,0
LCD_RC2402 = drill 0.8 pad 1.676: P$1 -53.96,-7.62; P$2 -56.5,-7.62; P$3 -53.96,-5.08; P$4 -56.5,-5.08; P$5 -53.96,-2.54; P$6 -56.5,-2.54; P$7 -53.96,0; P$8 -56.5,0; P$9 -53.96,2.54; P$10 -56.5,2.54; P$11 -53.96,5.08; P$12 -56.5,5.08; P$13 -53.96,7.62; P$14 -56.5,7.62; P$15 -53.96,10.16; P$16 -56.5,10.16 | hole 2.5: -56.5,-15.5; -56.5,15.5; 56.5,15.5; 56.5,-15.5
POWERSUPPLY_DC-21MM = drill 1.3 pad 4 octagon: 1 -5.08,-3.353; 2 -0.076,-6.35; 3 -0.076,-0.356 | drill 1.3: 4 -5.08,-4.115; 5 -5.08,-2.591; 6 -0.838,-0.356; 7 0.686,-0.356; 8 -0.838,-6.35; 9 0.686,-6.35

### Placement (x,y rotation side)
C1  159.29,114.28 270 top
C2  159.29,119.72 90 top
C3  155.98,107.63 0 top
C4  122.43,111.69 180 top
C5  122.43,101.28 180 top
C6  59.44,84.51 270 top
C7  59.44,89.85 90 top
C8  45.97,81.69 0 top
C9  171.61,96.61 90 top
C10  96.01,106.86 0 top
C11  27.18,155.63 90 top
C12  119.38,94.93 90 top
C13  15.75,103.05 90 top
C14  15.75,125.91 270 top
C15  174.13,145.07 180 top
C16  190.84,96.61 180 top
C17  182.01,99.16 90 top
C18  177.96,99.16 90 top
C19  175.02,184.79 0 top
C20  183.37,194.02 90 top
C21  191.06,102.49 180 top
C22  122.28,94.93 90 top
C23  125.22,94.93 90 top
D1  162.5,191 90 top
D10  32.51,86.04 180 top
EXT  192.5,169.47 90 top
IA  193,71 90 top
IC1  138.65,108.91 90 top
IC2  45.97,89.85 90 top
IC3  84.33,102.29 90 top
IC4  187.45,141.29 0 top
IC7  180.51,90.01 180 top
ID1  137.41,8.5 0 top
ID2  178.31,8.5 0 top
JP1  10.92,123.37 90 top
JP2  10.92,111.44 90 top
JP3  187.25,127.08 180 top
JP4  187.25,107.08 180 top
LCD_CONTRAST  27.89,191.14 90 top
OD1  36.35,8.5 0 top
OD2  77.24,8.5 0 top
OK1  119.63,29.65 0 top
OK2  129.79,29.65 0 top
OK3  139.95,29.65 0 top
OK4  150.11,29.65 0 top
OK5  160.53,29.65 0 top
OK6  170.69,29.65 0 top
OK7  180.85,29.65 0 top
OK8  191.01,29.65 0 top
OK9  8,29.65 180 top
OK10  22,29.65 180 top
OK11  36,29.65 180 top
OK12  50,29.65 180 top
OK13  64,29.65 180 top
OK14  78,29.65 180 top
OK15  92,29.65 180 top
OK16  106,29.65 180 top
Q1  54.86,87.05 90 top
R1  122.43,104.32 180 top
R2  122.43,108.64 180 top
R3  158.5,191 270 top
R4  32.26,91.12 180 top
R5  32.26,94.67 180 top
R6  14.49,62.5 270 top
R7  28.65,62.5 270 top
R8  42.81,62.5 270 top
R9  56.72,62.5 270 top
R10  70.88,62.5 270 top
R11  84.28,62.5 270 top
R12  98.69,62.5 270 top
R13  112.34,62.5 270 top
R14  119.63,20.5 0 top
R15  119.63,43.11 90 top
R16  129.79,16.44 0 top
R17  129.79,43.11 90 top
R18  139.95,20.5 0 top
R19  139.95,43.11 90 top
R20  150.11,16.44 0 top
R21  150.11,43.11 90 top
R22  160.53,20.5 0 top
R23  160.53,43.11 90 top
R24  170.69,16.44 0 top
R25  170.69,43.11 90 top
R26  181.1,20.5 0 top
R27  180.85,43.11 90 top
R28  191.01,16.44 0 top
R29  191.01,43.11 90 top
R30  15.75,113.98 270 top
R31  132.82,161.66 90 top
R32  132.82,176.16 270 top
R33  158.36,177.39 90 top
R34  158.18,161.39 90 top
R35  32.26,81.46 0 top
R36  14.49,43.11 90 top
R37  28.65,43.11 90 top
R38  42.81,43.11 90 top
R39  56.72,43.11 90 top
R40  70.88,43.11 90 top
R41  84.28,43.11 90 top
R42  98.69,43.11 90 top
R43  112.34,43.11 90 top
S1  151.01,191.87 90 top
S2  139.83,161.66 270 top
S3  139.83,177.16 270 top
S4  151.17,177.16 90 top
S5  151.17,161.66 90 top
SC1  14.73,81.46 270 top
SPI  155.38,82.57 180 top
T1  8,62.5 270 top
T2  22,62.5 270 top
T3  36,62.5 270 top
T4  50,62.5 270 top
T5  64,62.5 270 top
T6  78,62.5 270 top
T7  92,62.5 270 top
T8  106,62.5 270 top
TMP1  10.92,103.05 90 top
U1  74.96,168.99 0 top
X1  174.99,196.39 0 top
XT1  154.94,115.75 270 top

### Tracks (layer width: path | path; a pad name or v marks a point on that pad's centre or on a via)
+3V3
  Bottom 0.61: JP4.1 C21.1
  Bottom 1.016: IC7.2 180.51,95.12 C17.1 182.12,96.62 185,99.5 191.5,99.5 191.75,99.75 | 191.75,99.75 193.5,101.5 193.5,102.39 C21.1 | C16.+ 192.62,98.88 191.75,99.75
+5V  (via drill 0.8)
  Top 0.61: v153.5,105 v153.5,91.5 | v176.66,149 176.66,179.45 v176.71,179.5 | v132.84,168.68 161.47,168.68 v161.57,168.58
  Top 1.27: v129,77 v150,77 | v115.94,106.32 115.94,89.07 v116.96,88.04 | v108.71,137.85 v108.71,165.48
  Bottom 0.61: IC1.10 152.93,107.64 C3.1 153.44,105.06 v153.5,105 | C10.1 92.71,106.1 IC3.9 85.09,106.1 84.33,106.86 84.33,110.17 83.31,111.18 IC3.18 | R2.2 R1.2 | 4.16,101.18 4.06,101.28 | R33.2 158.5,181.34 R3.2 D1.C | C15.1 176.67,148.98 v176.66,149 | 132.82,168.66 v132.84,168.68 | 132.84,172.33 R32.2 | 27.27,153 C11.1 | 172.48,179.5
  Bottom 0.813: R5.2 R4.2 | R4.2 28.45,87.05 D10.A | 6.6,91.62 7.11,91.62 | 27.94,91.62 R4.2 | JP1.3 C14.1 | 4.19,101.66 4.06,101.53 | C13.1 12.06,100.51 TMP1.1 | C10.1 93.47,109.15 99.06,114.74 99.06,128.2 v108.71,137.85
  Bottom 1.016: 4.06,101.53 4.06,101.28 | C15.1 IC4.14 | R36.2 14.48,46.92 | IC7.3 177.97,94.5 | 177.97,94.5 177.97,96.61 C18.1 | 177.64,94.83 177.97,94.5
  Bottom 1.27: 4.06,128.45 4.06,116.52 | 4.06,116.52 4.06,101.53 | 4.06,101.28 4.06,94.16 6.6,91.62 4,89.02 4,50.69 6.5,48.19 13.21,48.19 14.48,46.92 | 7.11,91.62 27.94,91.62 | JP2.3 4.06,116.52 | v108.71,137.85 112.28,134.29 112.28,109.98 v115.94,106.32 116.62,106.32 R1.2 | TMP1.1 4.16,101.18 | 177.64,94.83 C9.+ 168.28,91.5 163.5,91.5 | v153.5,91.5 163.5,91.5 | SPI.2 160.8,81.3 163.5,84 | 163.5,84 163.5,91.5 | v150,77 153,74 164,74 166,76 166,81.5 163.5,84 | v116.96,88.04 128,77 v129,77 | R31.2 | 27.27,153 37,153 42,158 46,158 | 46,158 101.23,158 v108.71,165.48 | 4.06,128.45 JP1.3 | 4.06,128.45 4.06,184.06 16,196 31,196 | 31,196 33,196 37,192 37,185 46,176 46,158 | LCD_CONTRAST.E 30.43,195.43 31,196 | U1.P$2 18.45,159.54 25,153 27.09,153 C11.1
  Bottom 1.422: R29.2 R27.2 R25.2 R23.2 R21.2 R19.2 R17.2 R15.2 R43.2 R42.2 R41.2 R40.2 R39.2 R38.2 R37.2 R36.2 | v108.71,165.48 R31.2 | C20.+ 181.17,190.04 X1.2 172.48,187.61 C19.1 | D1.C 164.9,184.79 C19.1 | R34.2 v161.57,168.58 172.48,179.5 | 172.48,179.5 C19.1 | v176.71,179.5 172.48,179.5 | R31.2 132.82,168.66 | v132.84,168.68 132.84,172.33
AIN1
  Bottom 0.61: IC1.33 131.04,102.55 132.59,102.55 137.67,97.47 137.67,81.9 149.29,70.28 174,70.28 192.22,88.5 192.72,88.5 IA.8
AIN2
  Bottom 0.61: IC1.34 131.04,100.01 132.59,100.01 136.4,96.2 136.4,81.14 148.78,68.76 178,68.76 187.84,78.6 IA.6
AIN3
  Bottom 0.61: IC1.35 131.04,97.47 132.59,97.47 135.13,94.93 135.13,80.38 148.27,67.23 180.77,67.23 181.97,68.44 IA.4
AIN4
  Bottom 0.61: IC1.36 131.04,94.93 132.59,94.93 133.86,93.66 133.86,79.61 147.76,65.71 179.79,65.71 187.22,58.28 IA.2
BATERIE
  Bottom 0.813: SC1.+ R35.1
BUTON1
  Bottom 0.61: R31.1 137.01,157.85 S2.4 | S2.4 S2.3 | IC1.1 146.26,84.77 145.03,84.77 139.45,90.35 139.45,99.98 135.14,104.28 135.14,149.14 137.5,151.5 137.5,158.34 S2.4
BUTON2
  Bottom 0.61: IC1.2 146.26,87.31 144.78,87.31 140.72,91.37 140.72,100.74 136.67,104.79 136.67,148.17 140,151.5 140,169.5 137.57,171.93 S3.4 S3.3 133.26,180.41 R32.1
BUTON3
  Bottom 0.61: IC1.3 146.26,89.85 144.53,89.85 142.24,92.13 142.24,101.25 138.19,105.3 138.19,146.19 145,153 145,176 146,177 153.43,177 | 153.5,173.99 S4.3 | S4.3 158.02,173.91 R33.1 | S4.4 153.43,177 | 153.43,177 S4.3
BUTON4
  Bottom 0.61: R34.1 153.99,157.58 S5.3 | S5.3 S5.4 | IC1.4 146.26,92.39 144.27,92.39 143.51,93.15 143.51,102.01 139.72,105.81 139.72,144 153.43,157.71 S5.3
CO1
  Bottom 1.016: OK9.5 8,18 12.5,13.5 18.65,13.5 OD1.2
CO2
  Bottom 1.016: OK10.5 22,20.31 OD1.4
CO3
  Bottom 1.016: OK11.5 36,16.47 OD1.6
CO4
  Bottom 1.016: OK12.5 50,12.63 OD1.8
CO5
  Bottom 1.016: OK13.5 64,9.04 OD2.2
CO6
  Bottom 1.016: OK14.5 78,15.5 74.5,12 74.5,8.71 OD2.4
CO7
  Bottom 1.016: OK15.5 92,20 85,13 85,8.69 OD2.6
CO8
  Bottom 1.016: OK16.5 106,19.52 OD2.8
EO1
  Bottom 1.016: OK9.4 5.46,16.54 13.5,8.5 18.52,8.5 OD1.1
EO2
  Bottom 1.016: OK10.4 19.46,17.77 OD1.3
EO3
  Bottom 1.016: OK11.4 33.46,13.93 OD1.5
EO4
  Bottom 1.016: OK12.4 47.46,10.09 OD1.7
EO5
  Bottom 1.016: OK13.4 61.46,10.54 OD2.1
EO6
  Bottom 1.016: OK14.4 75.46,16.96 69.5,11 69.5,8.62 OD2.3
EO7
  Bottom 1.016: OK15.4 89.46,21.46 80,12 80,8.77 OD2.5
EO8
  Bottom 1.016: OK16.4 103.46,24.46 90,11 90,8.61 OD2.7
ETH_CS  (via drill 0.8)
  Top 0.61: v172.21,137.48 v172.21,110.85
  Bottom 0.61: JP4.4 185.93,107.13 185.93,109.07 184.15,110.85 v172.21,110.85 172.21,106.21 160.94,94.94 IC1.5 | IC4.1 179.35,137 172.69,137 v172.21,137.48
ETH_INT
  Bottom 0.61: IC4.5 189.99,131.91 188.23,130.15 184.4,130.15 183.39,129.13 183.39,127.13 JP3.5
ETH_MISO  (via drill 0.8)
  Top 0.61: v176.27,122.28 v176.27,140.53
  Bottom 0.61: JP3.3 188.52,123.6 187.2,122.28 v176.27,122.28 | v176.27,140.53 181.35,140.53 182.37,139.52 IC4.2
ETH_MOSI  (via drill 0.8)
  Top 0.61: v161.5,78 v161.5,99
  Bottom 0.61: JP3.2 191.06,128.56 192.5,130 195.5,130 196.5,129 196.5,122 191,116.5 170.5,116.5 168.5,114.5 168.5,106 v161.5,99 160,97.5 146.29,97.5 IC1.6 | SPI.4 155.38,78.62 156,78 v161.5,78
ETH_SCK  (via drill 0.8)
  Top 0.61: v155.5,87.5 v155.5,102.56
  Bottom 0.61: JP3.1 193.6,122.1 190,118.5 166.5,118.5 163,115 163,107.07 158.49,102.56 v155.5,102.56 IC1.8 | SPI.3 155.38,87.38 v155.5,87.5
GND
  pour Bottom (isolate 0.7): -6.86,204.72 257.3,204.72 257.8,30.67 -6.1,30.67
ICP
  Bottom 0.61: IC1.20 150.5,133.04 153,135.54 153,145.5 189.5,182 192.32,182 EXT.7
INT0
  Bottom 0.61: IC1.16 148.38,122.88 159,133.5 159,143.5 177.5,162 192.31,162 EXT.3
INT1
  Bottom 0.61: IC1.17 148.92,125.42 157.5,134 157.5,144 180.41,166.91 EXT.4 192.39,167
LCD_D4  (via drill 0.8)
  Top 0.61: v29.21,144.2 v29.21,174.17
  Bottom 0.61: IC1.26 127.24,120.34 120.14,127.44 120.14,139.88 114.3,145.73 30.73,145.73 v29.21,144.2 | v29.21,174.17 21.1,174.17 U1.P$11
LCD_D5
  Bottom 0.61: IC1.27 127.75,117.8 118.62,126.93 118.62,139.38 113.79,144.2 34.04,144.2 31.24,141.41 26.92,141.41 22.61,145.73 14.73,145.73 9.91,150.55 9.91,163.76 15.49,169.35 15.49,173.31 16.26,174.07 U1.P$12
LCD_D6  (via drill 0.8)
  Top 0.61: v35.05,141.15 v35.05,176.71
  Bottom 0.61: IC1.28 128.26,115.26 117.09,126.42 117.09,138.87 113.28,142.68 36.58,142.68 v35.05,141.15 | v35.05,176.71 21.1,176.71 U1.P$13
LCD_D7
  Bottom 0.61: IC1.29 128.77,112.72 115.57,125.91 115.57,138.36 112.78,141.15 39.88,141.15 36.45,137.72 33.66,137.72 31.5,139.88 26.42,139.88 22.1,144.2 14.22,144.2 8.38,150.04 8.38,164.27 13.97,169.86 13.97,173.92 16.76,176.71 18.35,176.71 U1.P$14
LCD_E
  Bottom 0.61: U1.P$6 14.63,166.45 11.43,163.25 11.43,151.06 15.24,147.25 114.81,147.25 121.67,140.39 121.67,127.95 126.75,122.87 131.02,122.87 IC1.25
LCD_RS
  Bottom 0.61: U1.P$4 14.12,163.91 12.95,162.74 12.95,151.57 15.75,148.77 115.57,148.77 123.19,141.15 123.19,128.45 126.24,125.41 131.02,125.41 IC1.24
LIMINA  (via drill 0.8)
  Top 0.61: v108.46,126.68 v54.36,126.68
  Bottom 0.61: IC1.37 125.23,92.4 125.23,92.39 C23.1 125.22,93.4 123.19,95.43 118.62,95.43 108.46,105.59 v108.46,126.68 | JP2.2 15.75,113.98 22.1,120.33 49.28,120.33 54.36,125.41 v54.36,126.68
MISO  (via drill 0.8)
  Top 0.61: v166,113.5 v166,128 | v158,87.5 v158,100.02
  Bottom 0.61: IC1.7 v158,100.02 159.02,100.02 166,107 v166,113.5 | IC4.3 184.92,137.27 184.92,134.92 183.5,133.5 171.5,133.5 v166,128 | SPI.1 157.92,87.42 v158,87.5
N$1
  Bottom 0.61: IC1.12 154.44,112.72 XT1.2 155.14,113.01 C1.2
N$2
  Bottom 0.61: IC1.13 151.9,115.26 XT1.1 154.97,118.32 154.97,120.04 155.91,120.99 C2.2
N$3
  Bottom 0.813: IC2.2 53.85,88.58 Q1.2 56.39,91.12 C7.2
N$4
  Bottom 0.61: IC1.30 127.77,110.18 R2.1 124.97,109.91 C4.1
N$5
  Bottom 0.61: IC1.32 131.02,105.09 130,105.09 129.18,104.27 126.3,104.27 R1.1 126.24,102.55 C5.1
N$6
  Bottom 0.61: R13.1 111.15,67.5 103,67.5 95.78,74.72 82.3,74.72 77.52,79.5 77.52,84.52 78.78,85.78 IC3.28
N$7
  Bottom 0.61: IC3.27 78.23,88.32 75.72,85.81 75.72,78.5 81.03,73.19 95.25,73.19 98.69,69.75 R12.1
N$8
  Bottom 0.61: IC3.26 77.72,90.86 74.2,87.34 74.2,77.48 84.28,67.4 R11.1
N$9
  Bottom 0.61: IC3.25 77.72,93.4 70.87,86.54 70.87,66.32 R10.1
N$10
  Bottom 0.61: R9.1 56.72,68.84 58.17,70.29 66.29,70.29 69.34,73.34 69.34,88.07 77.22,95.94 IC3.24
N$11
  Bottom 0.813: IC2.1 53.34,86.04 Q1.1 56.13,83.24 C6.2
N$12
  Bottom 0.61: R8.1 42.81,69.67 44.96,71.81 65.53,71.81 67.82,74.1 67.82,89.59 76.71,98.48 IC3.23
N$13
  Bottom 0.61: IC3.22 75.95,101.02 66.29,91.37 66.29,74.61 65.02,73.34 32.51,73.34 28.65,69.48 R7.1
N$14
  Bottom 0.61: R36.1 14.49,37.41 OK9.1
N$15
  Bottom 0.61: R6.1 14.49,69.51 14.48,69.53 19.81,74.86 62.99,74.86 64.77,76.64 64.77,93.15 75.18,103.56 IC3.21
N$16  (via drill 0.8)
  Top 0.61: v7.87,53 v7.87,43
  Bottom 0.61: T1.3 8,53.14 v7.87,53 | v7.87,43 7.87,33.58 OK9.2
N$17
  Bottom 0.61: R37.1 28.65,37.57 OK10.1
N$18
  Bottom 0.61: T1.2 13.63,62.5 14.48,61.65 14.48,58.71 R6.2
N$19
  Bottom 0.61: T2.2 27.6,62.5 28.7,61.4 28.7,58.74 R7.2
N$20
  Bottom 0.61: R38.1 42.81,37.73 OK11.1
N$21
  Bottom 0.61: T3.2 41.8,62.5 42.8,61.5 42.8,58.7 R8.2
N$22
  Bottom 0.61: T4.2 55.87,62.5 56.77,61.6 56.77,58.74 R9.2
N$23
  Bottom 0.61: R39.1 56.72,37.64 OK12.1
N$24
  Bottom 0.61: R40.1 70.88,37.8 OK13.1
N$25
  Bottom 0.61: T5.2 70.02,62.5 70.87,61.65 70.87,58.7 R10.2
N$26  (via drill 0.8)
  Top 0.61: v26,183 v26,164
  Bottom 0.61: LCD_CONTRAST.S 25.35,183.65 v26,183 | v26,164 21.08,164 U1.P$3
N$27
  Bottom 0.61: 21,179 U1.P$15 21.15,179 28,179 30.43,181.43 LCD_CONTRAST.A
N$28
  Bottom 0.61: T6.2 83.48,62.5 84.33,61.65 84.33,58.74 R11.2
N$29
  Bottom 0.61: R41.1 84.28,37.2 OK14.1
N$30
  Bottom 0.61: R42.1 98.69,37.61 OK15.1
N$31
  Bottom 0.61: T7.2 97.68,62.5 98.7,61.47 98.7,58.7 R12.2
N$32
  Bottom 0.61: T8.2 111.42,62.5 112.27,61.65 112.27,58.77 R13.2
N$33
  Bottom 0.61: OK1.1 117.09,21.77 R14.1
N$34  (via drill 0.8)
  Top 0.61: v133.1,42.86 v133.1,63.43
  Bottom 0.61: OK1.5 R15.1 121.92,39.3 125.48,42.86 v133.1,42.86 | v133.1,63.43 130.56,63.43 128.78,65.21 128.78,70.86 96.08,103.56 IC3.8
N$35
  Bottom 0.61: ID1.1 119.61,25.82 OK1.2
N$36
  Bottom 0.61: R43.1 112.34,37.26 OK16.1
N$37  (via drill 0.8)
  Top 0.61: v135.89,60.89 v135.89,39.3
  Bottom 0.61: OK2.5 R17.1 v135.89,39.3 | IC3.7 96.33,101.02 127.25,70.1 127.25,60.89 128.27,59.87 134.87,59.87 v135.89,60.89
N$38
  Bottom 0.61: OK2.1 127.25,17.71 R16.1
N$39
  Bottom 0.61: OK2.2 129.79,10.05 ID1.3
N$40
  Bottom 0.61: R16.2 133.6,9.77 ID1.4
N$41  (via drill 0.8)
  Top 0.61: v143.51,59.37 v143.51,39.3
  Bottom 0.61: OK3.5 R19.1 v143.51,39.3 | IC3.6 96.84,98.48 125.73,69.59 125.73,59.37 126.75,58.35 142.49,58.35 v143.51,59.37
N$42
  Bottom 0.61: OK3.1 137.41,21.77 R18.1
N$43
  Bottom 0.61: OK3.2 139.95,9.05 ID1.5
N$44
  Bottom 0.61: R18.2 143,19.74 143,10.54 ID1.6
N$45  (via drill 0.8)
  Top 0.61: v147.32,57.84 v147.32,39.3
  Bottom 0.61: OK4.5 R21.1 v147.32,39.3 | IC3.5 97.35,95.94 124.21,69.08 124.21,58.1 125.48,56.83 146.3,56.83 v147.32,57.84
N$46
  Bottom 0.61: OK4.1 147.57,17.71 R20.1
N$47
  Bottom 0.61: OK4.2 150.11,9.05 ID1.7
N$48
  Bottom 0.61: R20.2 153.92,9.77 ID1.8
N$49  (via drill 0.8)
  Top 0.61: v154.69,56.83 v154.69,39.3
  Bottom 0.61: IC3.4 97.85,93.4 122.68,68.57 122.68,56.83 124.21,55.3 153.16,55.3 v154.69,56.83 | v154.69,39.3 R23.1 OK5.5
N$50
  Bottom 0.61: OK5.1 157.99,21.77 R22.1
N$51
  Bottom 0.61: OK5.2 160.53,9.05 ID2.1
N$52
  Bottom 0.61: R22.2 164.34,20.25 163.58,19.49 163.58,10.54 ID2.2
N$53  (via drill 0.8)
  Top 0.61: v165.61,55.56 v165.61,39.3
  Bottom 0.61: OK6.5 R25.1 v165.61,39.3 | IC3.3 98.36,90.86 121.16,68.07 121.16,56.06 123.44,53.78 163.83,53.78 v165.61,55.56
N$54
  Bottom 0.61: OK6.1 168.15,17.71 R24.1
N$55
  Bottom 0.61: OK6.2 170.69,9.05 ID2.3
N$56
  Bottom 0.61: R24.2 174.5,9.77 ID2.4
N$57  (via drill 0.8)
  Top 0.61: v175.51,54.03 v175.51,39.3
  Bottom 0.61: OK7.5 R27.1 v175.51,39.3 | IC3.2 98.87,88.32 119.63,67.56 119.63,55.3 122.68,52.25 173.74,52.25 v175.51,54.03
N$58
  Bottom 0.61: OK7.1 178.31,21.52 R26.1
N$59  (via drill 0.8)
  Top 0.61: v22.1,53 v22.1,43
  Bottom 0.61: T2.3 22,53.37 v22.1,53 | v22.1,43 22.1,33.56 OK10.2
N$60
  Bottom 0.61: R26.2 183.9,19.49 183.9,10.54 ID2.6
N$61  (via drill 0.8)
  Top 0.61: v185.42,50.73 v185.42,39.3
  Bottom 0.61: OK8.5 R29.1 v185.42,39.3 | IC3.1 99.38,85.78 118.11,67.05 118.11,54.54 121.92,50.73 v185.42,50.73
N$62
  Bottom 0.61: OK8.1 188.47,17.71 R28.1
N$63
  Bottom 0.61: OK8.2 191.01,9.05 ID2.7
N$64
  Bottom 0.61: R28.2 194.82,9.77 ID2.8
N$65
  Bottom 0.813: JP2.1 12.19,110.17 R30.2
N$66  (via drill 0.8)
  Top 0.61: v36.07,53 v36.07,43
  Bottom 0.61: T3.3 36,53.08 v36.07,53 | v36.07,43 36.07,33.53 OK11.2
N$67  (via drill 0.8)
  Top 0.61: v50.04,53 v50.04,43
  Bottom 0.61: T4.3 50,53.05 v50.04,53 | v50.04,43 50.04,33.5 OK12.2
N$68  (via drill 0.8)
  Top 0.61: v64.01,53 v64.01,43
  Bottom 0.61: T5.3 64,53.53 v64.01,53 | v64.01,43 OK13.2
N$69  (via drill 0.8)
  Top 0.61: v77.98,53 v77.98,43
  Bottom 0.61: T6.3 78,54.05 v77.98,53 | v77.98,43 77.98,33.48 OK14.2
N$70  (via drill 0.8)
  Top 0.61: v91.95,53 v91.95,43
  Bottom 0.61: T7.3 92,54.34 v91.95,53 | v91.95,43 91.95,33.51 OK15.2
N$71  (via drill 0.8)
  Top 0.61: v105.92,53 105.92,43.36 v105.66,43
  Bottom 0.61: T8.3 106,54.37 v105.92,53 | v105.66,43 105.66,33.79 OK16.2
N$86
  Bottom 0.61: OK7.2 180.85,9.05 ID2.5
N$90
  Bottom 0.813: R35.2 37.59,82.99 D10.C IC2.8 42.16,82.96 C8.1
N$91
  Bottom 0.61: R14.2 122.68,19.74 122.68,10.54 ID1.2
OC1A
  Bottom 0.61: IC1.19 150,130.5 154.5,135 154.5,145 186.5,177 192.4,177 EXT.6
OC1B
  Bottom 0.61: IC1.18 149.46,127.96 156,134.5 156,144.5 183.5,172 EXT.5
OC2  (via drill 0.8)
  Top 0.61: v131.06,136.84 v149.61,136.84
  Bottom 0.61: IC1.21 131.03,136.8 v131.06,136.84 | v149.61,136.84 149.61,144.11 192.5,187 192.47,187.03 EXT.8
RESET  (via drill 0.8)
  Top 0.61: v143,141.5 v131,141.5 | v151,105 v151,88 | v123,155 v123,180
  Bottom 0.61: S1.3 153.28,192 | 153.28,192 S1.4 153.58,194.81 R3.1 D1.A | v143,141.5 141.5,140 141.5,106 142.4,105.1 IC1.9 149.9,105.1 v151,105 | v131,141.5 131,147 v123,155 | 153.28,192 128.5,192 123,186.5 v123,180 | v151,88 151,85.67 SPI.5
RXD
  Bottom 0.61: IC1.14 147.3,117.8 162,132.5 162,142.5 173.5,154 179.3,154 181.63,151.66 EXT.1
SCL  (via drill 0.8)
  Top 0.61: v127,133.53 v94.74,133.53
  Bottom 0.61: IC3.12 91.44,113.72 94.74,117.02 v94.74,133.53 92.2,133.53 90.68,132.01 73.66,132.01 71.12,129.47 71.12,111.69 60.45,101.02 43.18,101.02 39.12,96.96 35.56,96.96 33.78,95.18 33.78,91.88 34.54,91.12 R4.1 IC2.6 | v127,133.53 130.04,130.5 IC1.22
SDA  (via drill 0.8)
  Top 0.61: v92.71,129.47 v127,129.47
  Bottom 0.61: IC3.13 91.19,116.26 92.71,117.79 v92.71,129.47 75.44,129.47 73.66,127.69 73.66,110.93 61.47,98.74 44.45,98.74 42.16,96.45 IC2.5 | v127,129.47 128.51,127.96 IC1.23
  Bottom 0.813: R5.1 41.15,94.67 IC2.5
TEMPERATURA  (via drill 0.8)
  Top 0.61: v104.14,121.6 v56.64,121.6
  Bottom 0.61: TMP1.2 17.27,103.05 30.99,116.77 51.82,116.77 v56.64,121.6 | IC1.39 131.02,87.31 123.44,87.31 119.38,91.37 C12.1 117.09,92.39 104.14,105.34 v104.14,121.6
TXD
  Bottom 0.61: IC1.15 147.84,120.34 160.5,133 160.5,143 174.5,157 192.23,157 EXT.2
UMIDITATE  (via drill 0.8)
  Top 0.61: v106.17,124.14 v46.99,124.14
  Bottom 0.61: JP1.2 17.53,125.91 19.3,124.14 v46.99,124.14 | IC1.38 131.02,89.85 123.95,89.85 122.28,91.52 C22.1 122.28,92.79 120.9,94.16 117.6,94.16 106.17,105.59 v106.17,124.14

### Text on the board
Bottom: AUTOMAT PROGRAMABIL PENTRU SISTEME DOMOTICE | SCARLAT CRISTIAN